# EAGLE design JumpLogic (EAGLE 5.11)
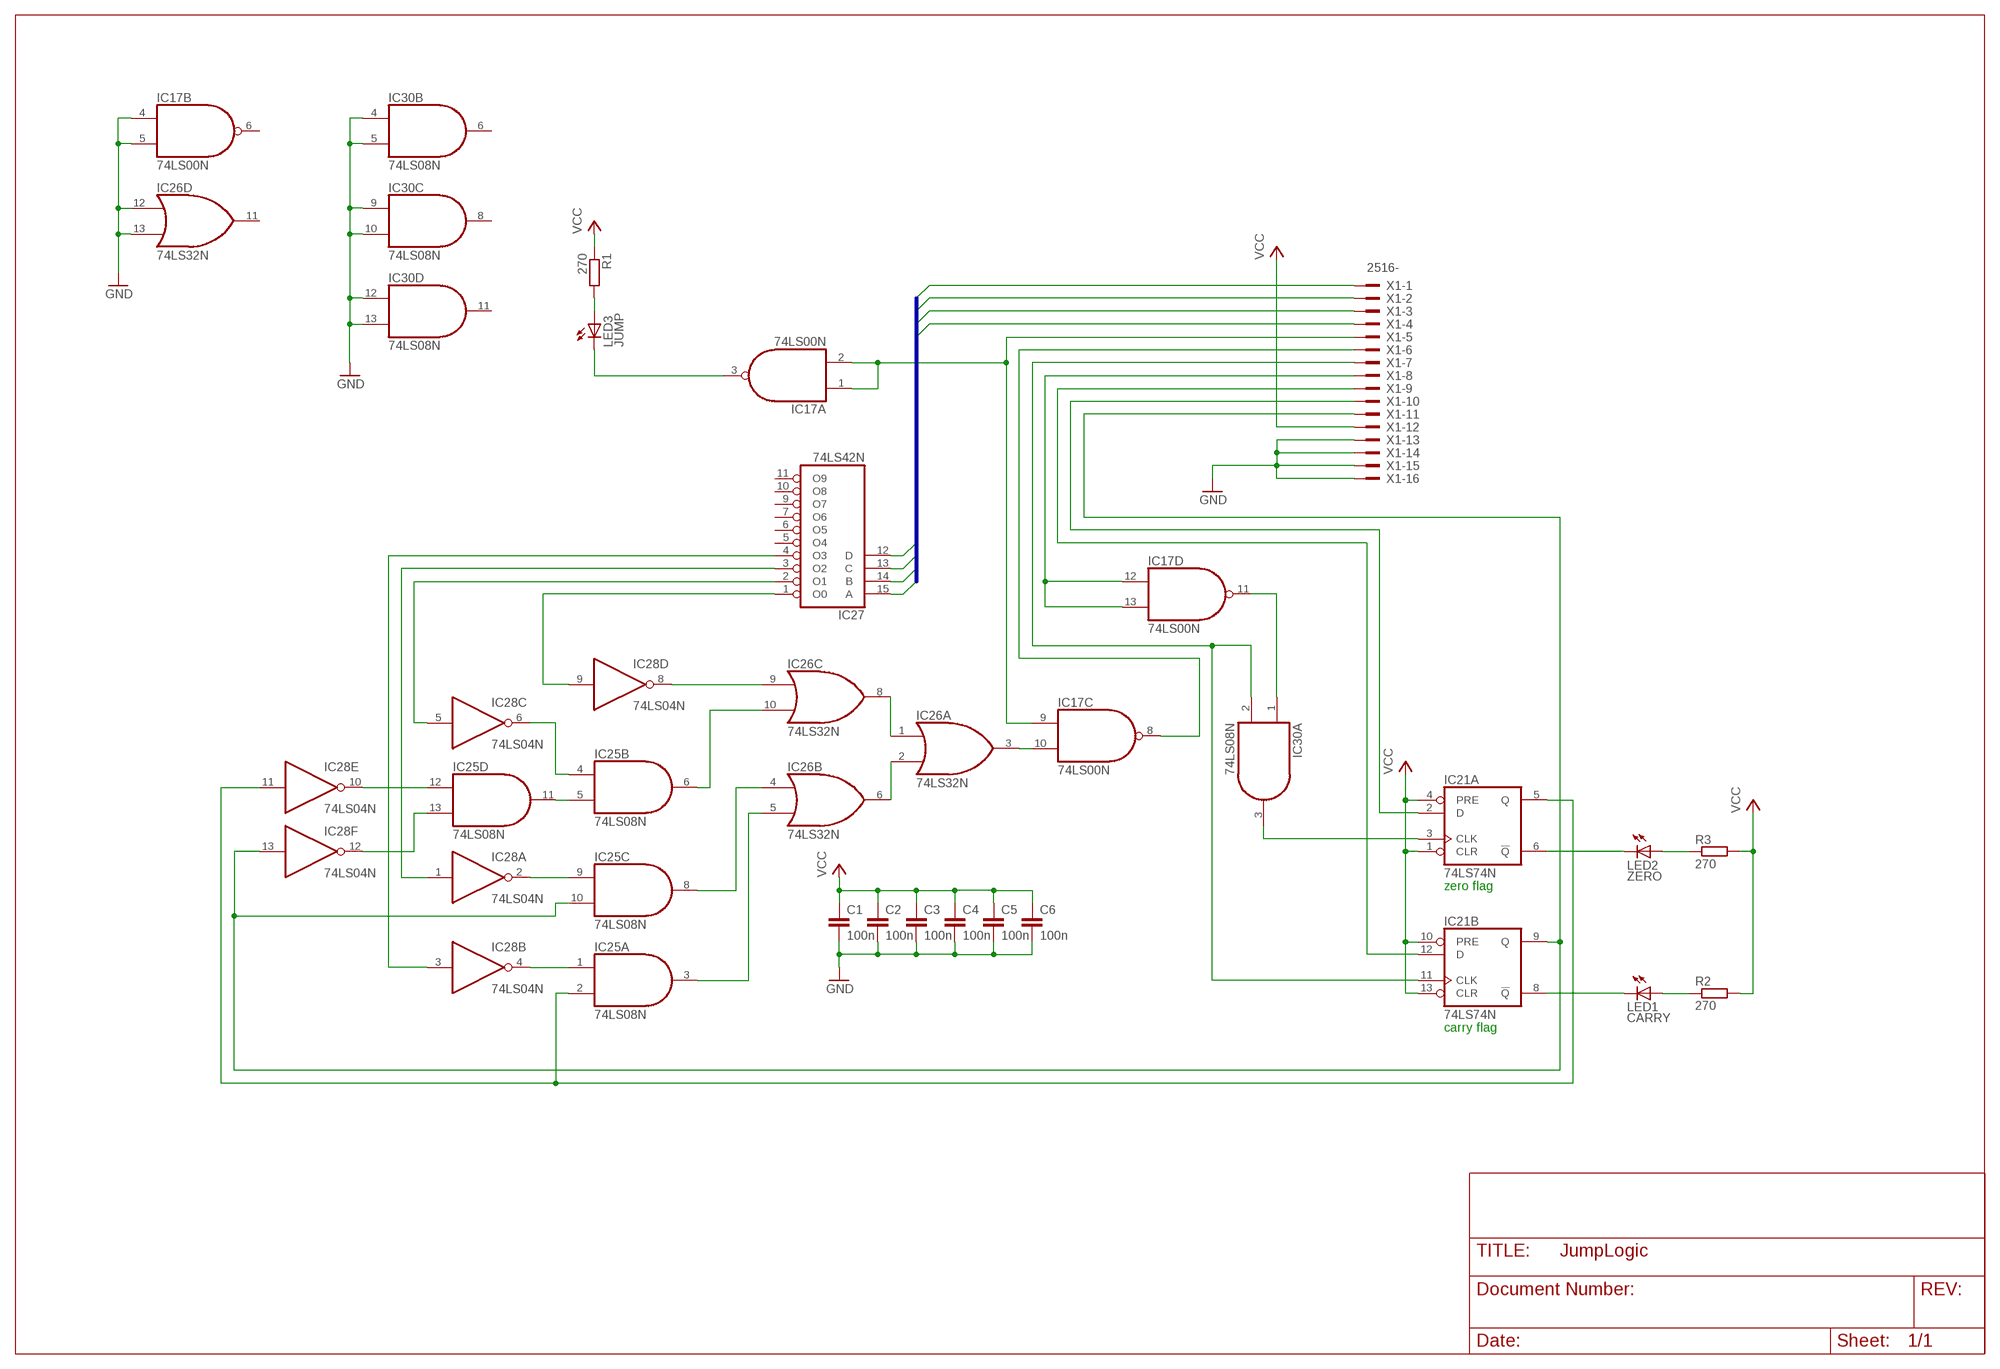
[diagram p0: schematic, sheet 1]

## Parts
C1  100n  C-EU050-025X075  [C050-025X075]
C2  100n  C-EU050-025X075  [C050-025X075]
C3  100n  C-EU050-025X075  [C050-025X075]
C4  100n  C-EU050-025X075  [C050-025X075]
C5  100n  C-EU050-025X075  [C050-025X075]
C6  100n  C-EU050-025X075  [C050-025X075]
IC17  74LS00N  [DIL14]
IC21  74LS74N  [DIL14]
IC25  74LS08N  [DIL14]
IC26  74LS32N  74S32N  [DIL14]
IC27  74LS42N  [DIL16]
IC28  74LS04N  [DIL14]
IC30  74LS08N  [DIL14]
LED1  CARRY  LED5MM  [LED5MM]
LED2  ZERO  LED5MM  [LED5MM]
LED3  JUMP  LED5MM  [LED5MM]
R1  270  R-EU_0207/10  [0207/10]
R2  270  R-EU_0207/10  [0207/10]
R3  270  R-EU_0207/10  [0207/10]
X1  2516-  [PAK100/2500-16]

## Nets
/CARRY: IC25.13(D:I1) IC28.12(F:O)
/CARRY_LED: IC21.8(B:!Q) LED1.K(C)
/INST_JA: IC27.2(O1) IC28.5(C:I)
/INST_JB: IC27.3(O2) IC28.1(A:I)
/INST_JMP: IC27.1(O0) IC28.9(D:I)
/INST_JZ: IC27.4(O3) IC28.3(B:I)
/LOAD_FROM_ALU: IC17.12(D:I0) IC17.13(D:I1) X1.8
/LOAD_PC: IC17.8(C:O) X1.6
/ZERO: IC25.12(D:I0) IC28.10(E:O)
/ZERO/CARRY: IC25.5(B:I1) IC25.11(D:O)
/ZERO_LED: IC21.6(A:!Q) LED2.K(C)
CARRY: IC21.9(B:Q) IC25.10(C:I1) IC28.13(F:I) X1.11
CARRY_IN: IC21.12(B:D) X1.9
EXEC_JA: IC25.6(B:O) IC26.10(C:I1)
EXEC_JB: IC25.8(C:O) IC26.4(B:I0)
EXEC_JUMP: IC17.1(A:I0) IC17.2(A:I1) IC17.9(C:I0) X1.5
EXEC_JZ: IC25.3(A:O) IC26.5(B:I1)
GND: C1.2 C2.2 C3.2 C4.2 C5.2 C6.2 IC17.4(B:I0) IC17.5(B:I1) IC26.12(D:I0) IC26.13(D:I1) IC30.4(B:I0) IC30.5(B:I1) IC30.9(C:I0) IC30.10(C:I1) IC30.12(D:I0) IC30.13(D:I1) X1.13 X1.14 X1.15 X1.16
IMM0: IC27.15(A) X1.1
IMM1: IC27.14(B) X1.2
IMM2: IC27.13(C) X1.3
IMM3: IC27.12(D) X1.4
INST_JA: IC25.4(B:I0) IC28.6(C:O)
INST_JB: IC25.9(C:I0) IC28.2(A:O)
INST_JMP: IC26.9(C:I0) IC28.8(D:O)
INST_JZ: IC25.1(A:I0) IC28.4(B:O)
LOAD_CARRY: IC21.11(B:CLK) IC30.2(A:I1) X1.7
LOAD_FROM_ALU: IC17.11(D:O) IC30.1(A:I0)
LOAD_ZERO: IC21.3(A:CLK) IC30.3(A:O)
N$1: LED3.A R1.2
N$2: IC17.10(C:I1) IC26.3(A:O)
N$3: IC17.3(A:O) LED3.K(C)
N$4: IC26.2(A:I1) IC26.6(B:O)
N$22: LED1.A R2.1
N$23: IC26.1(A:I0) IC26.8(C:O)
N$30: LED2.A R3.1
VCC: C1.1 C2.1 C3.1 C4.1 C5.1 C6.1 IC21.1(A:CLR) IC21.4(A:PRE) IC21.10(B:PRE) IC21.13(B:CLR) R1.1 R2.2 R3.2 X1.12
ZERO: IC21.5(A:Q) IC25.2(A:I1) IC28.11(E:I)
ZERO_IN: IC21.2(A:D) X1.10
Unconnected: IC17.6(B:O) IC26.11(D:O) IC27.5(O4) IC27.6(O5) IC27.7(O6) IC27.9(O7) IC27.10(O8) IC27.11(O9) IC30.6(B:O) IC30.8(C:O) IC30.11(D:O)

## Buses
IMM[0..3]

## Notes on the sheet
- zero flag
- carry flag

## Power pins joined to a net without a drawn wire
GND: IC17.7(P:GND) IC21.7(P:GND) IC25.7(P:GND) IC26.7(P:GND) IC27.8(GND) IC28.7(P:GND) IC30.7(P:GND)
VCC: IC17.14(P:VCC) IC21.14(P:VCC) IC25.14(P:VCC) IC26.14(P:VCC) IC27.16(VCC) IC28.14(P:VCC) IC30.14(P:VCC)

## Library data of the parts
C1-C6 = rcl:C-EU: CAPACITOR, European symbol
IC17 = 74xx-us:74*00: Quad 2-input NAND gate
IC21 = 74xx-us:74*74: Dual D type positive edge triggered FLIP FLOP, preset and clear
IC25 IC30 = 74xx-us:74*08: Quad 2-input AND gate
IC26 = 74xx-us:74*32: Quad 2-input OR gate
IC27 = 74xx-us:74*42: 4-line to 10-line DECODER (1-of-10)
IC28 = 74xx-us:74*04: Hex INVERTER
LED1-LED3 = led:LED: LED OSRAM: - CHIPLED LG R971, LG N971, LY N971, LG Q971, LY Q971, LO R971, LY R971 LH N974, LH R974 LS Q976, LO Q976, LY Q976 LO Q996 - Hyper CHIPLED LW Q18S LB Q993, LB Q99A, LB R99A - SideLED LS A670, LO A670, LY A670, LG A670, LP A670 LB A673, LV A673, LT A673, LW A673 LH A674 LY A675 LS A676, LA A676, LO A676, LY A676, LW A676 LS A679, LY A679, LG A679 - Hyper Micro SIDELED® LS Y876, LA Y876, LO Y876, LY Y876 LT Y87S - SmartLED LW L88C, LW L88S LB L89C, LB L89S, LG L890 LS L89K, LO L89K, LY L89K LS L896, LA L896, LO L896, LY L896 - TOPLED LS T670, LO T670, LY T670, LG T670, LP T670 LSG T670, LSP T670, LSY T670, LOP T670, LYG T670 LG T671, LOG T671, LSG T671 LB T673, LV T673, LT T673, LW T673 LH T674 LS T676, LA T676, LO T676, LY T676, LB T676, LH T676, LSB T676, LW T676 LB T67C, LV T67C, LT T67C, LS T67K, LO T67K, LY T67K, LW E67C LS E67B, LA E67B, LO E67B, LY E67B, LB E67C, LV E67C, LT E67C LW T67C LS T679, LY T679, LG T679 LS T770, LO T770, LY T770, LG T770, LP T770 LB T773, LV T773, LT T773, LW T773 LH T774 LS E675, LA E675, LY E675, LS T675 LS T776, LA T776, LO T776, LY T776, LB T776 LHGB T686 LT T68C, LB T68C - Hyper Mini TOPLED® LB M676 - Mini TOPLED Santana® LG M470 LS M47K, LO M47K, LY M47K Source: http://www.osram.convergy.de LUXEON: - LUMILED® LXK2-PW12-R00, LXK2-PW12-S00, LXK2-PW14-U00, LXK2-PW14-V00 LXK2-PM12-R00, LXK2-PM12-S00, LXK2-PM14-U00 LXK2-PE12-Q00, LXK2-PE12-R00, LXK2-PE12-S00, LXK2-PE14-T00, LXK2-PE14-U00 LXK2-PB12-K00, LXK2-PB12-L00, LXK2-PB12-M00, LXK2-PB14-N00, LXK2-PB14-P00, LXK2-PB14-Q00 LXK2-PR12-L00, LXK2-PR12-M00, LXK2-PR14-Q00, LXK2-PR14-R00 LXK2-PD12-Q00, LXK2-PD12-R00, LXK2-PD12-S00 LXK2-PH12-R00, LXK2-PH12-S00 LXK2-PL12-P00, LXK2-PL12-Q00, LXK2-PL12-R00 Source: www.luxeon.com KINGBRIGHT: KA-3528ASYC Source: www.kingbright.com
R1-R3 = rcl:R-EU_: RESISTOR, European symbol
X1 = con-3m:2516-: 3M (TM) Pak 100 4-Wall Header Source: 3M; OC_FARNELL: unknown; OC_NEWARK: unknown

## Board
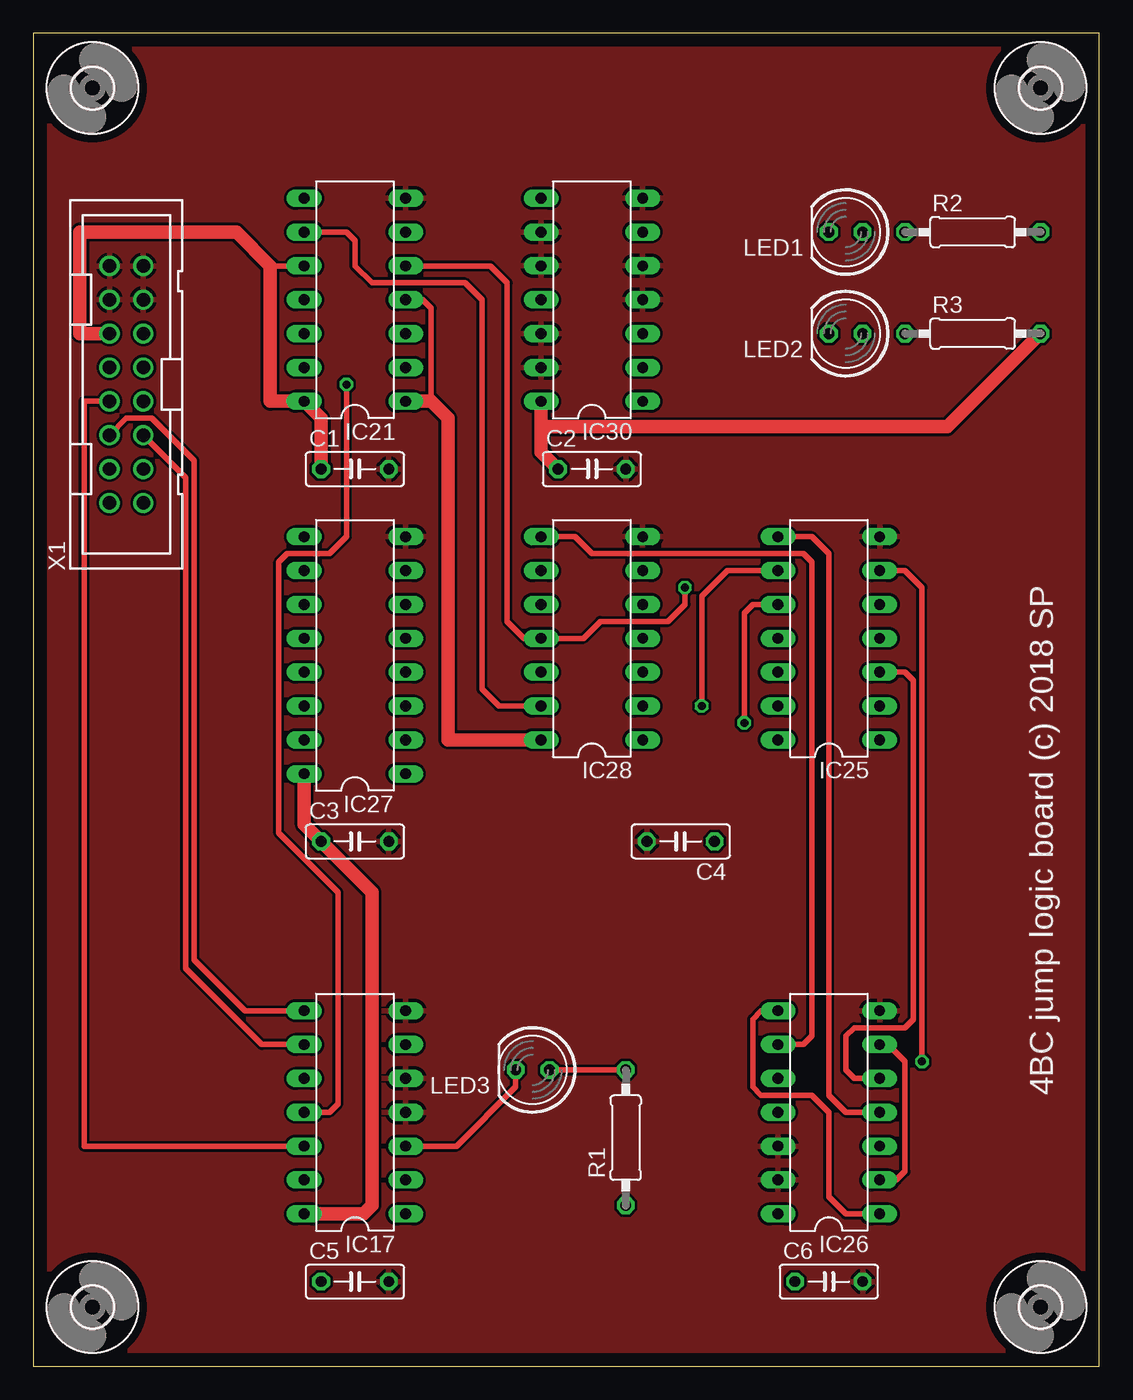
[diagram p1: board, top side]
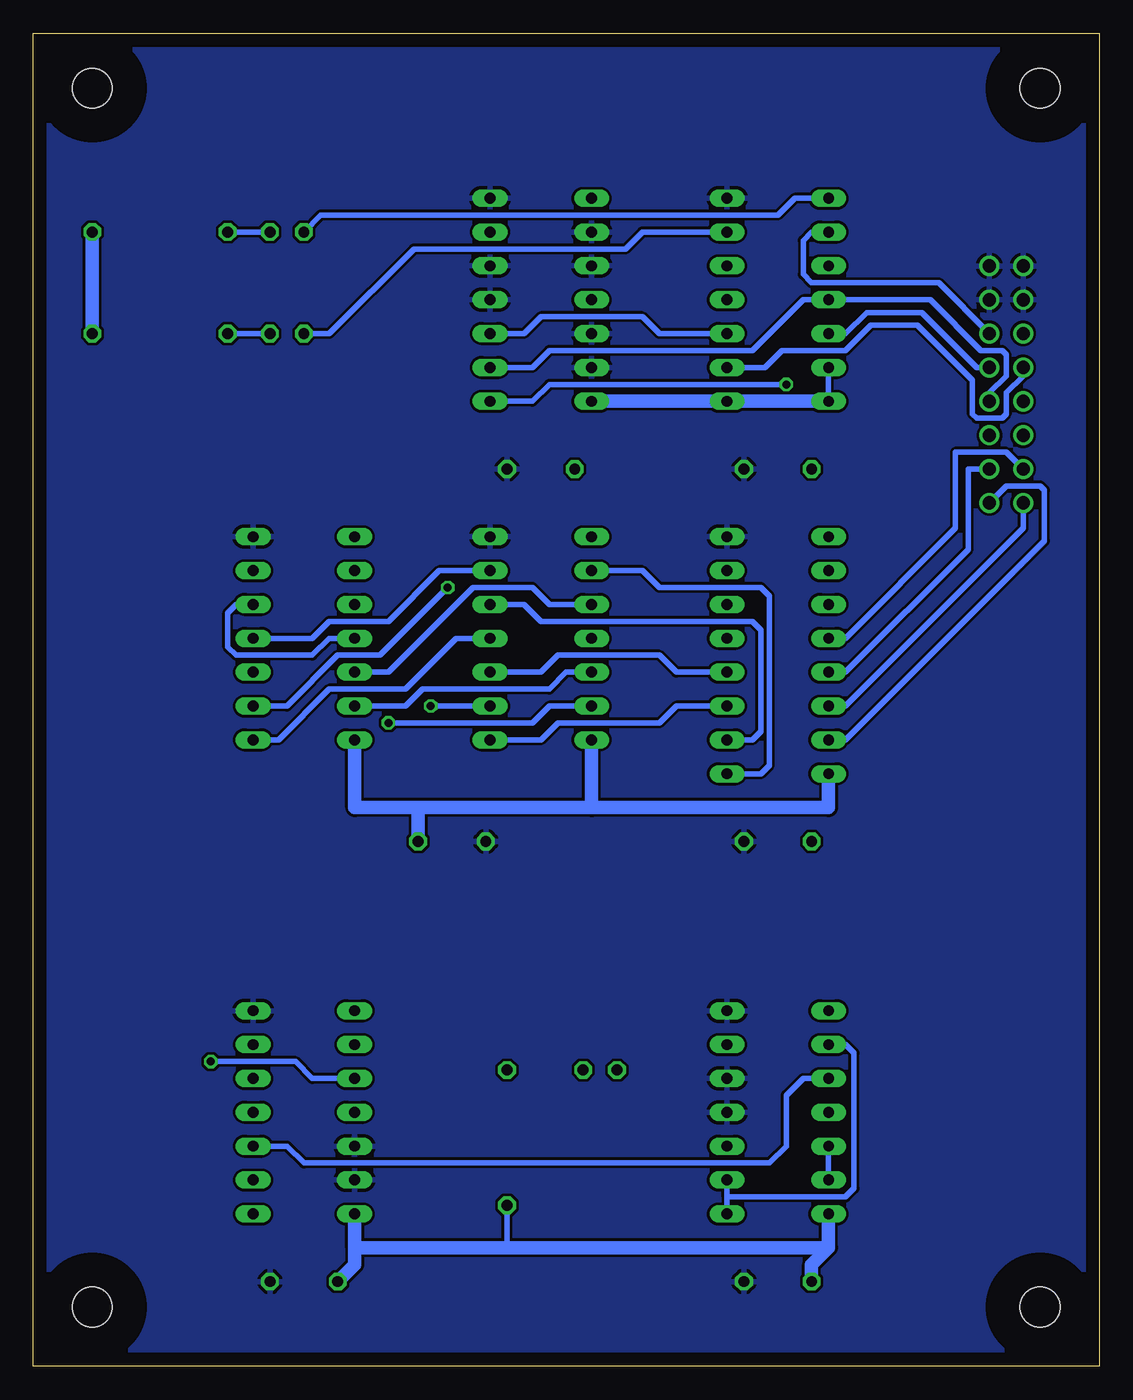
[diagram p2: board, bottom side, seen from below]

Size 79.99 x 100 mm. Coordinates in mm from the lower left corner, seen from the top.
Outline: 0,0 79.99,0 79.99,100 0,100 0,0
Copper layers (1*16): Top 0.035mm / dielectric 1.5mm / Bottom 0.035mm
Design rules "default *": minimum track width 10mil, minimum drill 16mil, track to track 8mil, track to pad 8mil, pad to pad 8mil, via to via 8mil, smd to smd 8mil, copper to edge 40mil, drill to drill 8mil, minimum pad ring 10mil, minimum via ring 8mil, stop-mask expansion 4mil, vias tented up to drill 0mil, thermal gap 10mil

### Footprints (pad centres in the part's own frame; a part is rotated, then mirrored left to right if it is on the bottom)
C050-025X075 = drill 0.813 octagon: 1 -2.54,0; 2 2.54,0
DIL14 = drill 0.813 long: 1 -7.62,-3.81; 2 -5.08,-3.81; 3 -2.54,-3.81; 4 0,-3.81; 5 2.54,-3.81; 6 5.08,-3.81; 7 7.62,-3.81; 8 7.62,3.81; 9 5.08,3.81; 10 2.54,3.81; 11 0,3.81; 12 -2.54,3.81; 13 -5.08,3.81; 14 -7.62,3.81
DIL16 = drill 0.813 long: 1 -8.89,-3.81; 2 -6.35,-3.81; 3 -3.81,-3.81; 4 -1.27,-3.81; 5 1.27,-3.81; 6 3.81,-3.81; 7 6.35,-3.81; 8 8.89,-3.81; 9 8.89,3.81; 10 6.35,3.81; 11 3.81,3.81; 12 1.27,3.81; 13 -1.27,3.81; 14 -3.81,3.81; 15 -6.35,3.81; 16 -8.89,3.81
LED5MM = drill 0.813 octagon: A -1.27,0; K 1.27,0
0207/10 = drill 0.813 octagon: 1 -5.08,0; 2 5.08,0
3,0 = hole 3: 0,0
PAK100/2500-16 = drill 1 pad 1.422 round: 1 -8.89,-1.27; 2 -8.89,1.27; 3 -6.35,-1.27; 4 -6.35,1.27; 5 -3.81,-1.27; 6 -3.81,1.27; 7 -1.27,-1.27; 8 -1.27,1.27; 9 1.27,-1.27; 10 1.27,1.27; 11 3.81,-1.27; 12 3.81,1.27; 13 6.35,-1.27; 14 6.35,1.27; 15 8.89,-1.27; 16 8.89,1.27

### Placement (x,y rotation side)
C1  24.13,67.31 0 top
C2  41.91,67.31 0 top
C3  24.13,39.37 0 top
C4  48.58,39.37 180 top
C5  24.13,6.35 0 top
C6  59.69,6.35 0 top
IC17  24.13,19.05 90 top
IC21  24.13,80.01 90 top
IC25  59.69,54.61 90 top
IC26  59.69,19.05 90 top
IC27  24.13,53.34 90 top
IC28  41.91,54.61 90 top
IC30  41.91,80.01 90 top
LED1  60.96,85.09 180 top
LED2  60.96,77.47 180 top
LED3  37.47,22.23 180 top
R1  44.45,17.14 90 top
R2  70.48,85.09 0 top
R3  70.48,77.47 0 top
U$1  [3,0]  4.45,95.89 0 top
U$2  [3,0]  75.56,95.89 0 top
U$3  [3,0]  75.56,4.45 0 top
U$4  [3,0]  4.45,4.45 0 top
X1  6.99,73.66 90 top

### Tracks (layer width: path | path; a pad name or v marks a point on that pad's centre or on a via)
/CARRY
  Bottom 0.406: IC25.13 52.07,49.53 50.8,50.8 41.27,50.8 40.01,52.07 IC28.12
/CARRY_LED
  Bottom 0.406: IC21.8 22.86,87.63 24.13,86.36 58.42,86.36 LED1.K
/INST_JA
  Bottom 0.406: IC28.5 43.18,57.15 41.91,55.88 26.04,55.88 25.4,55.24 25.4,47.62 26.04,46.99 IC27.2
/INST_JB
  Bottom 0.406: IC27.3 31.75,49.53 33.02,48.26 40.64,48.26 41.91,46.99 IC28.1
/INST_JMP
  Bottom 0.406: IC28.9 34.29,59.69 33.02,58.42 25.4,58.42 24.77,57.78 24.77,45.09 25.4,44.45 IC27.1
/INST_JZ
  Bottom 0.406: IC27.4 31.75,52.07 33.02,53.34 40.64,53.34 41.91,52.07 IC28.3
/LOAD_FROM_ALU
  Top 0.406: IC17.12 3.81,16.51 3.81,72.39 X1.8
  Bottom 0.406: IC17.12 IC17.13
/LOAD_PC
  Top 0.406: IC17.8 15.88,26.67 12.06,30.48 12.06,67.94 8.89,71.12 6.99,71.12 X1.6
/ZERO
  Bottom 0.406: IC25.12 53.34,52.07 46.99,58.42 42.55,58.42 41.27,57.15 IC28.10
/ZERO/CARRY
  Bottom 0.406: IC25.11 57.78,54.61 59.05,53.34 64.77,53.34 65.41,53.98 65.41,56.52 64.77,57.15 IC25.5
/ZERO_LED
  Bottom 0.406: IC21.6 34.29,85.09 35.56,83.82 51.44,83.82 57.78,77.47 LED2.K
CARRY  (via drill 0.6)
  Top 0.406: v53.34,48.26 53.34,56.52 53.98,57.15 IC25.10 | IC28.13 34.92,49.53 33.66,50.8 33.66,80.01 32.38,81.28 25.4,81.28 24.13,82.55 24.13,84.45 23.5,85.09 IC21.9
  Bottom 0.406: IC21.9 21.59,85.09 22.23,84.45 22.23,81.92 21.59,81.28 12.06,81.28 X1.11 | IC28.13 41.27,49.53 42.55,48.26 v53.34,48.26
CARRY_IN
  Bottom 0.406: IC21.12 19.05,77.47 17.46,79.06 13.34,79.06 9.21,74.93 X1.9
EXEC_JA  (via drill 0.6)
  Top 0.406: IC25.6 65.41,59.69 66.67,58.42 v66.67,22.86
  Bottom 0.406: v66.67,22.86 60.33,22.86 59.05,21.59 IC26.10
EXEC_JB
  Top 0.406: IC25.8 58.42,62.23 59.69,60.96 59.69,20.32 60.96,19.05 IC26.4
EXEC_JUMP
  Top 0.406: IC17.9 17.14,24.13 11.43,29.84 11.43,66.67 X1.5
  Bottom 0.406: 27.94,12.7 IC17.1 | 27.94,12.7 IC17.2 | IC17.9 19.05,24.13 18.41,23.5 18.41,13.34 19.05,12.7 27.94,12.7
EXEC_JZ
  Top 0.406: IC25.3 65.41,52.07 66.04,51.44 66.04,26.04 65.41,25.4 61.59,25.4 60.96,24.77 60.96,22.23 61.59,21.59 IC26.5
GND
  pour Bottom: 0,100.33 80.01,100.33 80.01,0 0,0
  pour Top: 0,99.69 80.01,99.69 80.01,0 0,0
IMM0
  Bottom 0.406: IC27.15 19.05,46.99 4.13,61.91 4.13,65.72 4.45,66.04 6.99,66.04 X1.1
IMM1
  Bottom 0.406: IC27.14 19.05,49.53 5.71,62.87 X1.2
IMM2
  Bottom 0.406: IC27.13 19.05,52.07 9.84,61.28 9.84,67.31 X1.3
IMM3
  Bottom 0.406: IC27.12 19.05,54.61 10.79,62.87 10.79,68.58 6.99,68.58 X1.4
INST_JA
  Bottom 0.406: IC25.4 59.05,54.61 57.78,55.88 53.34,55.88 49.53,59.69 IC28.6
INST_JB  (via drill 0.6)
  Top 0.406: v50.16,49.53 50.16,57.78 52.07,59.69 IC25.9
  Bottom 0.406: IC28.2 v50.16,49.53
INST_JMP
  Top 0.406: IC28.8 40.64,62.23 41.91,60.96 57.78,60.96 58.42,60.33 58.42,24.77 57.78,24.13 IC26.9
INST_JZ
  Bottom 0.406: IC28.4 48.26,54.61 52.07,50.8 57.78,50.8 61.59,46.99 IC25.1
LOAD_CARRY
  Bottom 0.406: IC30.2 42.55,74.93 41.27,76.2 26.04,76.2 22.23,80.01 IC21.11 12.7,80.01 8.89,76.2 7.3,76.2 6.99,75.88 6.99,74.3 8.26,73.03 X1.7
LOAD_FROM_ALU  (via drill 0.6)
  Top 0.406: IC17.11 22.23,19.05 22.86,19.68 22.86,35.56 18.41,40.01 18.41,60.33 19.05,60.96 22.23,60.96 23.5,62.23 v23.5,73.66
  Bottom 0.406: IC30.1 42.55,72.39 41.27,73.66 v23.5,73.66
LOAD_ZERO
  Bottom 0.406: IC30.3 43.18,77.47 41.91,78.74 34.29,78.74 33.02,77.47 IC21.3
N$1
  Top 0.406: LED3.A R1.2
N$2
  Bottom 0.406: IC26.3 60.96,16.51 59.69,15.24 24.77,15.24 23.5,16.51 23.5,20.32 22.23,21.59 IC17.10
N$3
  Top 0.406: LED3.K 36.2,20.95 31.75,16.51 IC17.3
N$4
  Top 0.406: IC26.6 64.14,24.13 65.41,22.86 65.41,14.61 64.77,13.97 IC26.2
N$22
  Bottom 0.406: LED1.A R2.1
N$23
  Top 0.406: IC26.1 60.96,11.43 59.69,12.7 59.69,19.05 58.42,20.32 54.61,20.32 53.98,20.95 53.98,26.04 54.61,26.67 IC26.8
N$30
  Bottom 0.406: LED2.A R3.1
VCC
  Top 0.406: IC21.4 29.21,80.01 29.84,79.38 29.84,72.39 | 17.78,82.55 IC21.10
  Top 1.016: C1.1 21.59,71.12 IC21.14 17.78,72.39 17.78,82.55 15.24,85.09 3.49,85.09 3.49,77.47 X1.12 | IC30.14 38.1,70.48 | 38.1,70.48 38.1,68.58 C2.1 | IC28.14 31.11,46.99 31.11,71.12 29.84,72.39 IC21.1 | IC27.16 20.32,40.64 C3.1 25.4,35.56 25.4,12.06 24.77,11.43 IC17.14 | R3.2 68.58,70.48 38.1,70.48
  Bottom 0.406: IC21.14 IC21.13 | 44.45,8.89 R1.1
  Bottom 1.016: R3.2 R2.2 | IC21.14 IC21.1 IC30.14 | IC27.16 20.32,41.91 38.1,41.91 | 38.1,41.91 IC28.14 | IC25.14 55.88,41.91 51.12,41.91 | 38.1,41.91 51.12,41.91 | C5.1 21.59,7.62 20.64,8.57 | 20.64,8.57 20.32,8.89 IC17.14 | 20.64,8.57 20.95,8.89 44.45,8.89 55.88,8.89 IC26.14 55.88,7.62 C6.1 | 51.12,41.91 C4.1
ZERO  (via drill 0.6)
  Top 0.406: IC21.5 34.29,82.55 35.56,81.28 35.56,55.88 36.83,54.61 IC28.11 41.27,54.61 42.55,55.88 47.62,55.88 48.9,57.15 v48.9,58.42
  Bottom 0.406: IC25.2 60.96,49.53 57.15,53.34 53.98,53.34 v48.9,58.42
ZERO_IN
  Bottom 0.406: IC21.2 25.08,74.93 23.81,76.2 19.05,76.2 17.14,78.11 13.65,78.11 9.53,73.98 9.53,71.44 9.21,71.12 7.3,71.12 6.99,71.44 6.99,73.03 5.71,74.3 X1.10

### Text on the board
tNames: 4BC jump logic board (c) 2018 SP